# EAGLE design +-12V_PSU (EAGLE 9.0.1)
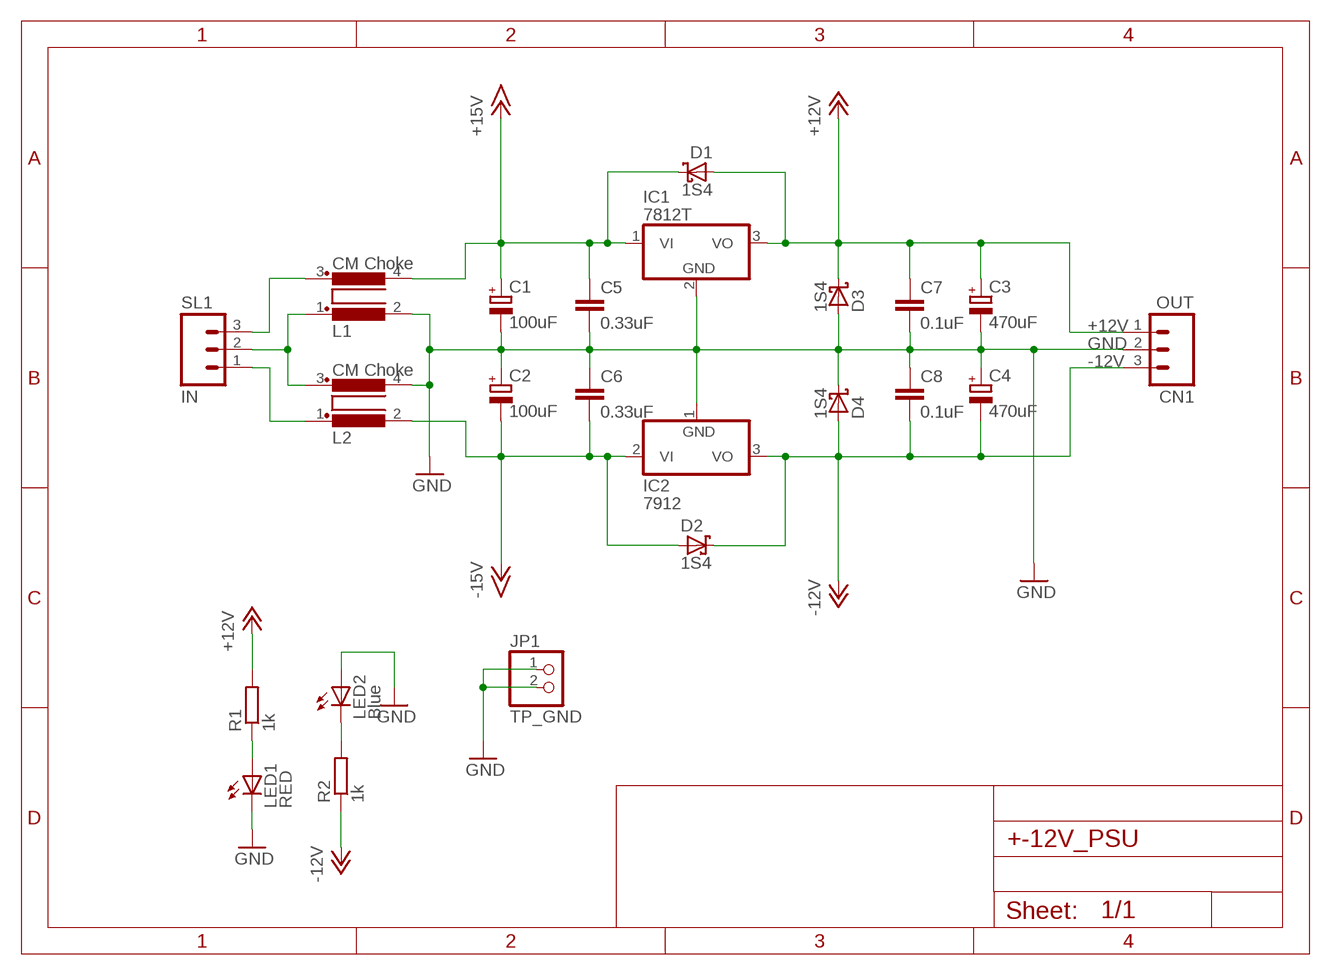
[diagram p0: schematic, sheet 1]

## Parts
C1  100uF  CPOL-EUE2.5-7  [E2,5-7]
C2  100uF  CPOL-EUE2.5-7  [E2,5-7]
C3  470uF  CPOL-EUE7.5-16  [E7,5-16]
C4  470uF  CPOL-EUE7.5-16  [E7,5-16]
C5  0.33uF  C-EU025-024X044  [C025-024X044]
C6  0.33uF  C-EU025-024X044  [C025-024X044]
C7  0.1uF  C-EU025-024X044  [C025-024X044]
C8  0.1uF  C-EU025-024X044  [C025-024X044]
CN1  OUT  AMP-EI-M3  [03PA]
D1  1S4  SCHOTTKY-DIODEDO35-7  [DO35-7]
D2  1S4  SCHOTTKY-DIODEDO35-7  [DO35-7]
D3  1S4  SCHOTTKY-DIODEDO35-7  [DO35-7]
D4  1S4  SCHOTTKY-DIODEDO35-7  [DO35-7]
IC1  7812T  [TO220H]
IC2  7912  7912T  [TO220H]
JP1  TP_GND  PINHD-1X2  [1X02]
L1  CM Choke  EV20  [EV20]
L2  CM Choke  EV20  [EV20]
LED1  RED  LED3MM  [LED3MM]
LED2  Blue  LED3MM  [LED3MM]
R1  1k  R-EU_0207/7  [0207/7]
R2  1k  R-EU_0207/7  [0207/7]
SL1  IN  AMP-EI-M3  [03PA]

## Nets
+12V: C3.+ C7.1 CN1.1 D1.A D3.C IC1.3(VO) R1.2
+15V: C1.+ C5.1 D1.C IC1.1(VI) L1.4
-12V: C4.- C8.2 CN1.3 D2.C D4.A IC2.3(VO) R2.1
-15V: C2.- C6.2 D2.A IC2.2(VI) L2.2
GND: C1.- C2.+ C3.- C4.+ C5.2 C6.1 C7.2 C8.1 CN1.2 D3.A D4.C IC1.2(GND) IC2.1(GND) JP1.1 JP1.2 L1.2 L2.4 LED1.K(C) LED2.A
N$1: L1.1 L2.3 SL1.2
N$2: L2.1 SL1.1
N$3: LED2.K(C) R2.2
N$4: LED1.A R1.1
N$5: L1.3 SL1.3

## Library data of the parts
C1-C4 = rcl:CPOL-EU: POLARIZED CAPACITOR, European symbol; SPICEPREFIX: C
C5-C8 = rcl:C-EU: CAPACITOR, European symbol; SPICEPREFIX: C
CN1 SL1 = mylib2:AMP-EI-M3: AMP EI 3P L型
D1-D4 = diode:SCHOTTKY-DIODE: Schottky Diode
IC1 = linear:78*: Positive VOLTAGE REGULATOR Source: http://cache.national.com/ds/LM/LM78L05.pdf http://www.fairchildsemi.com/ds/LM/LM7805.pdf
IC2 = linear:79*: Negative VOLTAGE REGULATOR
JP1 = pinhead:PINHD-1X2: PIN HEADER
L1 L2 = mylib2:EV20: EV20 Schaffner Common-mode Choke
LED1 LED2 = led:LED: LED OSRAM: - CHIPLED LG R971, LG N971, LY N971, LG Q971, LY Q971, LO R971, LY R971 LH N974, LH R974 LS Q976, LO Q976, LY Q976 LO Q996 - Hyper CHIPLED LW Q18S LB Q993, LB Q99A, LB R99A - SideLED LS A670, LO A670, LY A670, LG A670, LP A670 LB A673, LV A673, LT A673, LW A673 LH A674 LY A675 LS A676, LA A676, LO A676, LY A676, LW A676 LS A679, LY A679, LG A679 - Hyper Micro SIDELED® LS Y876, LA Y876, LO Y876, LY Y876 LT Y87S - SmartLED LW L88C, LW L88S LB L89C, LB L89S, LG L890 LS L89K, LO L89K, LY L89K LS L896, LA L896, LO L896, LY L896 - TOPLED LS T670, LO T670, LY T670, LG T670, LP T670 LSG T670, LSP T670, LSY T670, LOP T670, LYG T670 LG T671, LOG T671, LSG T671 LB T673, LV T673, LT T673, LW T673 LH T674 LS T676, LA T676, LO T676, LY T676, LB T676, LH T676, LSB T676, LW T676 LB T67C, LV T67C, LT T67C, LS T67K, LO T67K, LY T67K, LW E67C LS E67B, LA E67B, LO E67B, LY E67B, LB E67C, LV E67C, LT E67C LW T67C LS T679, LY T679, LG T679 LS T770, LO T770, LY T770, LG T770, LP T770 LB T773, LV T773, LT T773, LW T773 LH T774 LS E675, LA E675, LY E675, LS T675 LS T776, LA T776, LO T776, LY T776, LB T776 LHGB T686 LT T68C, LB T68C - Hyper Mini TOPLED® LB M676 - Mini TOPLED Santana® LG M470 LS M47K, LO M47K, LY M47K Source: http://www.osram.convergy.de LUXEON: - LUMILED® LXK2-PW12-R00, LXK2-PW12-S00, LXK2-PW14-U00, LXK2-PW14-V00 LXK2-PM12-R00, LXK2-PM12-S00, LXK2-PM14-U00 LXK2-PE12-Q00, LXK2-PE12-R00, LXK2-PE12-S00, LXK2-PE14-T00, LXK2-PE14-U00 LXK2-PB12-K00, LXK2-PB12-L00, LXK2-PB12-M00, LXK2-PB14-N00, LXK2-PB14-P00, LXK2-PB14-Q00 LXK2-PR12-L00, LXK2-PR12-M00, LXK2-PR14-Q00, LXK2-PR14-R00 LXK2-PD12-Q00, LXK2-PD12-R00, LXK2-PD12-S00 LXK2-PH12-R00, LXK2-PH12-S00 LXK2-PL12-P00, LXK2-PL12-Q00, LXK2-PL12-R00 Source: www.luxeon.com KINGBRIGHT: KA-3528ASYC Source: www.kingbright.com
R1 R2 = rcl:R-EU_: RESISTOR, European symbol; SPICEPREFIX: R

## Board
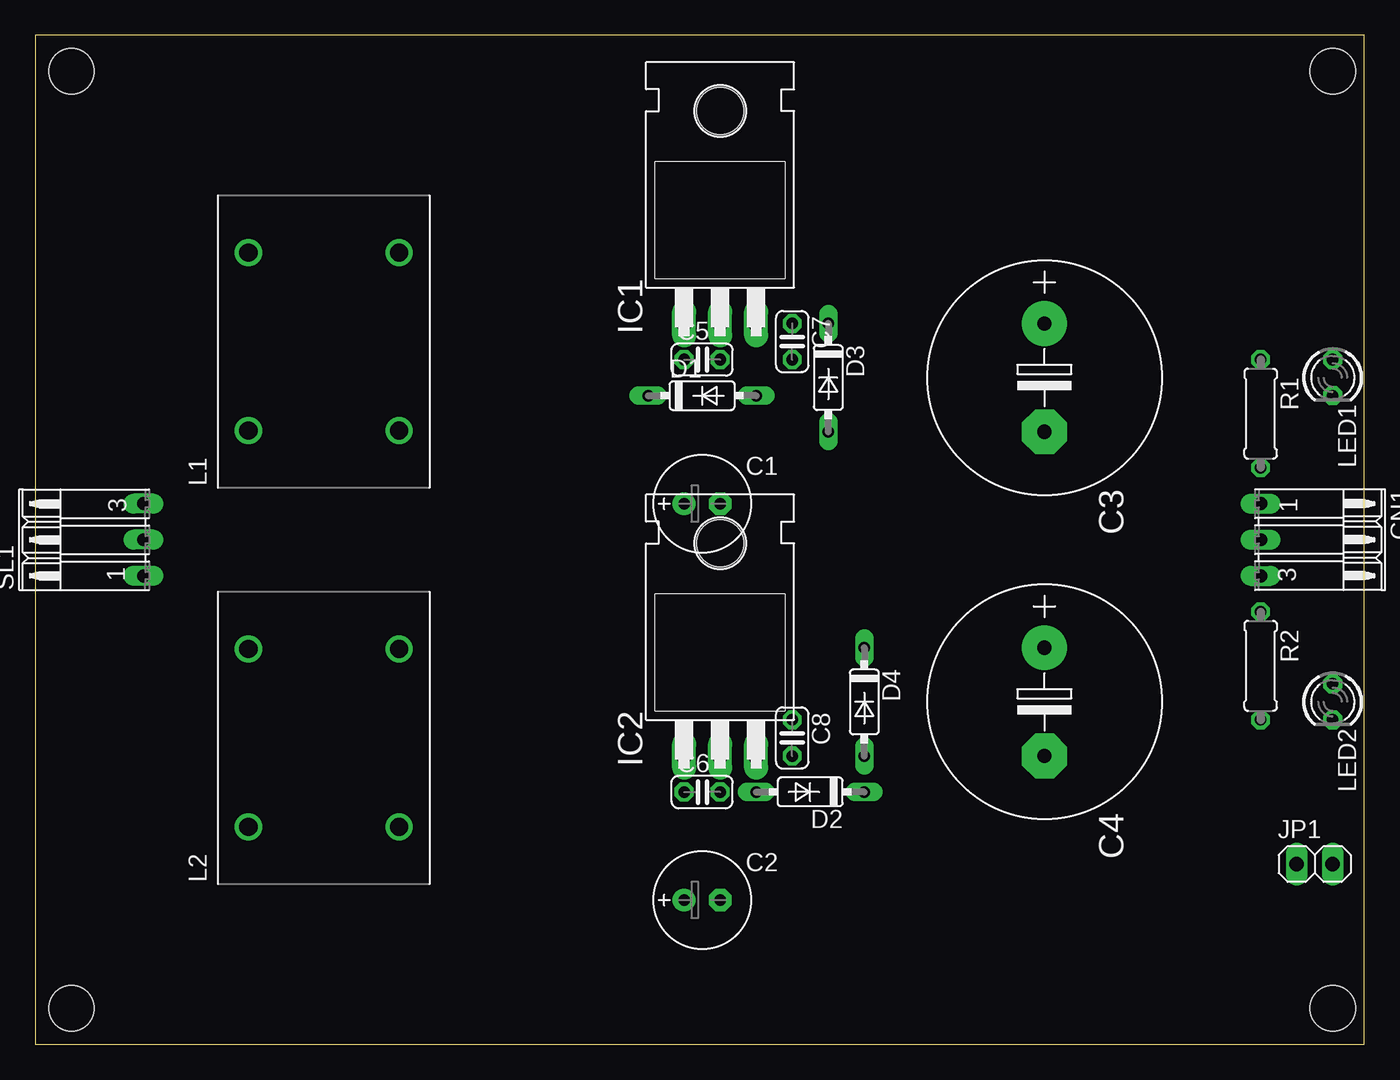
[diagram p1: board, top side]
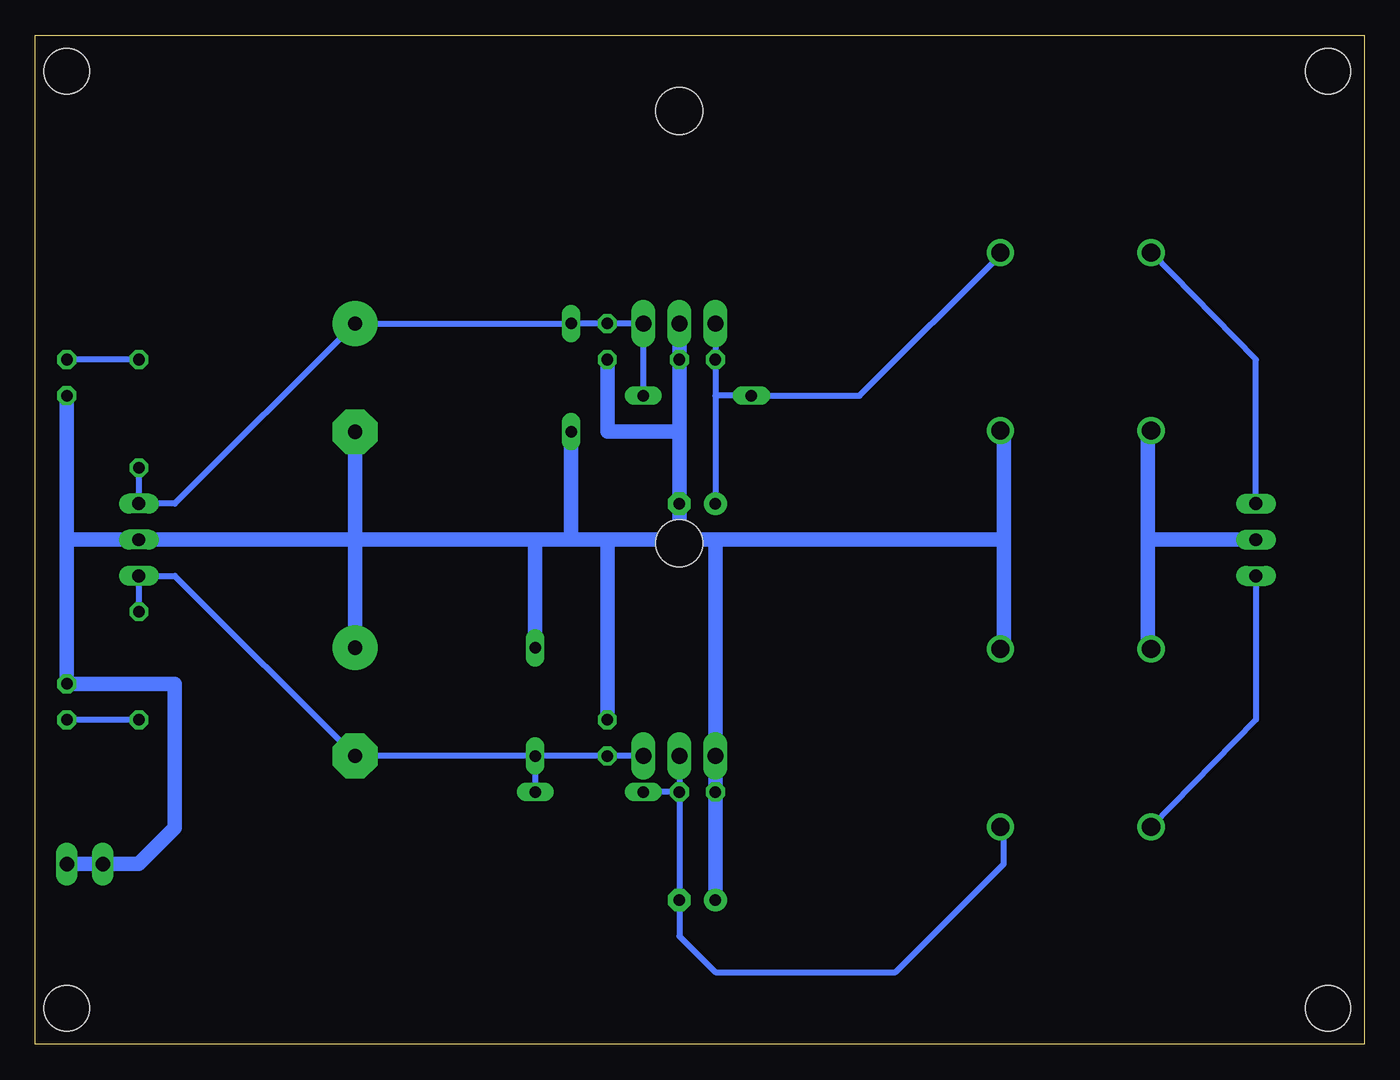
[diagram p2: board, bottom side, seen from below]

Size 93.65 x 71.11 mm. Coordinates in mm from the lower left corner, seen from the top.
Outline: 0,0 93.65,0 93.65,71.11 0,71.11 0,0
Copper layers (1*16): Top 0.035mm / dielectric 1.5mm / Bottom 0.035mm
Design rules "default": minimum track width 6mil, minimum drill 0.35mm, track to track 6mil, track to pad 6mil, pad to pad 6mil, via to via 6mil, smd to smd 6mil, copper to edge 40mil, drill to drill 6mil, minimum pad ring 10mil, minimum via ring 8mil, stop-mask expansion 4mil, vias tented up to drill 0mil, thermal gap 10mil
Holes 3.2 mm at 2.54,68.58 2.54,2.54 91.44,2.54 91.44,68.58

### Footprints (pad centres in the part's own frame; a part is rotated, then mirrored left to right if it is on the bottom)
E2,5-7 = drill 0.813 pad 1.6: + -1.27,0 | drill 0.813 pad 1.6 octagon: - 1.27,0
E7,5-16 = drill 1.016 pad 3.15: + -3.81,0 | drill 1.016 pad 3.15 octagon: - 3.81,0
C025-024X044 = drill 0.813 octagon: 1 -1.27,0; 2 1.27,0
03PA = drill 0.914 long: 1 -2.54,0; 2 0,0; 3 2.54,0
DO35-7 = drill 0.813 long: A 3.81,0; C -3.81,0
TO220H = drill 1.118 long: 1 -2.54,-10.16; 2 0,-10.16; 3 2.54,-10.16 | hole 3.302: 0,4.826
1X02 = drill 1.016 long: 1 -1.27,0; 2 1.27,0
EV20 = drill 1.27: 1 -2.46,10.39; 2 -2.46,-0.23; 3 10.08,10.39; 4 10.08,-0.23
LED3MM = drill 0.813 octagon: A -1.27,0; K 1.27,0
0207/7 = drill 0.813 octagon: 1 -3.81,0; 2 3.81,0

### Placement (x,y rotation side)
C1  46.99,38.1 0 top
C2  46.99,10.16 0 top
C3  71.12,46.99 270 top
C4  71.12,24.13 270 top
C5  46.99,48.26 0 top
C6  46.99,17.78 0 top
C7  53.34,49.53 270 top
C8  53.34,21.59 270 top
CN1  86.36,35.56 270 top
D1  46.99,45.72 0 top
D2  54.61,17.78 180 top
D3  55.88,46.99 270 top
D4  58.42,24.13 270 top
IC1  48.26,60.96 0 top
IC2  48.26,30.48 0 top
JP1  90.17,12.7 0 top
L1  25.4,45.72 90 top
L2  25.4,17.78 90 top
LED1  91.44,46.99 270 top
LED2  91.44,24.13 270 top
R1  86.36,44.45 270 top
R2  86.36,26.67 270 top
SL1  7.62,35.56 90 top

### Tracks (layer width: path | path; a pad name or v marks a point on that pad's centre or on a via)
+12V
  Bottom 0.406: D1.A IC1.3 C7.1 D3.C C3.+ 83.82,38.1 CN1.1 R1.2
+15V
  Bottom 0.406: IC1.1 C5.1 45.72,45.72 | 45.72,45.72 C1.+ | 45.72,45.72 D1.C 35.56,45.72 25.4,55.88 L1.4
-12V
  Bottom 0.406: R2.1 CN1.3 83.82,33.02 C4.- D4.A | IC2.3 C8.2 D4.A | D4.A D2.C
-15V
  Bottom 0.406: IC2.2 C6.2 | C6.2 C2.- 48.26,7.62 45.72,5.08 33.02,5.08 25.4,12.7 25.4,15.24 L2.2 | C6.2 D2.A
GND
  Bottom 1.016: 71.12,35.56 CN1.2 91.44,35.56 | 71.12,35.56 58.42,35.56 | 58.42,35.56 55.88,35.56 | 55.88,35.56 53.34,35.56 | 53.34,35.56 48.26,35.56 | 48.26,35.56 45.72,35.56 | 45.72,35.56 25.4,35.56 | 25.4,35.56 25.4,43.18 25.48,43.26 L1.2 | L2.4 25.4,28.09 25.4,35.56 | D4.C 58.42,35.56 | D3.A 55.88,35.56 | 48.26,35.56 C1.- 48.26,43.18 | C3.- 71.12,35.56 | C4.+ 71.12,35.56 | LED1.K 91.44,35.56 | IC1.2 C5.2 48.26,43.18 | C7.2 53.34,43.18 48.26,43.18 | C8.1 53.34,35.56 | 45.72,35.56 IC2.1 C6.1 C2.+ | JP1.2 JP1.1 86.36,12.7 83.82,15.24 83.82,25.4 LED2.A 91.44,35.56
N$1
  Bottom 1.016: SL1.2 15.24,35.56 | 15.24,35.56 15.24,43.18 15.09,43.18 L1.1 | L2.3 15.24,28.09 15.24,35.56
N$2
  Bottom 0.406: SL1.1 7.62,22.86 L2.1
N$3
  Bottom 0.406: R2.2 LED2.K
N$4
  Bottom 0.406: R1.1 LED1.A
N$5
  Bottom 0.406: SL1.3 7.62,48.26 L1.3